# EAGLE design Ethernet_v1 (EAGLE 6.1)
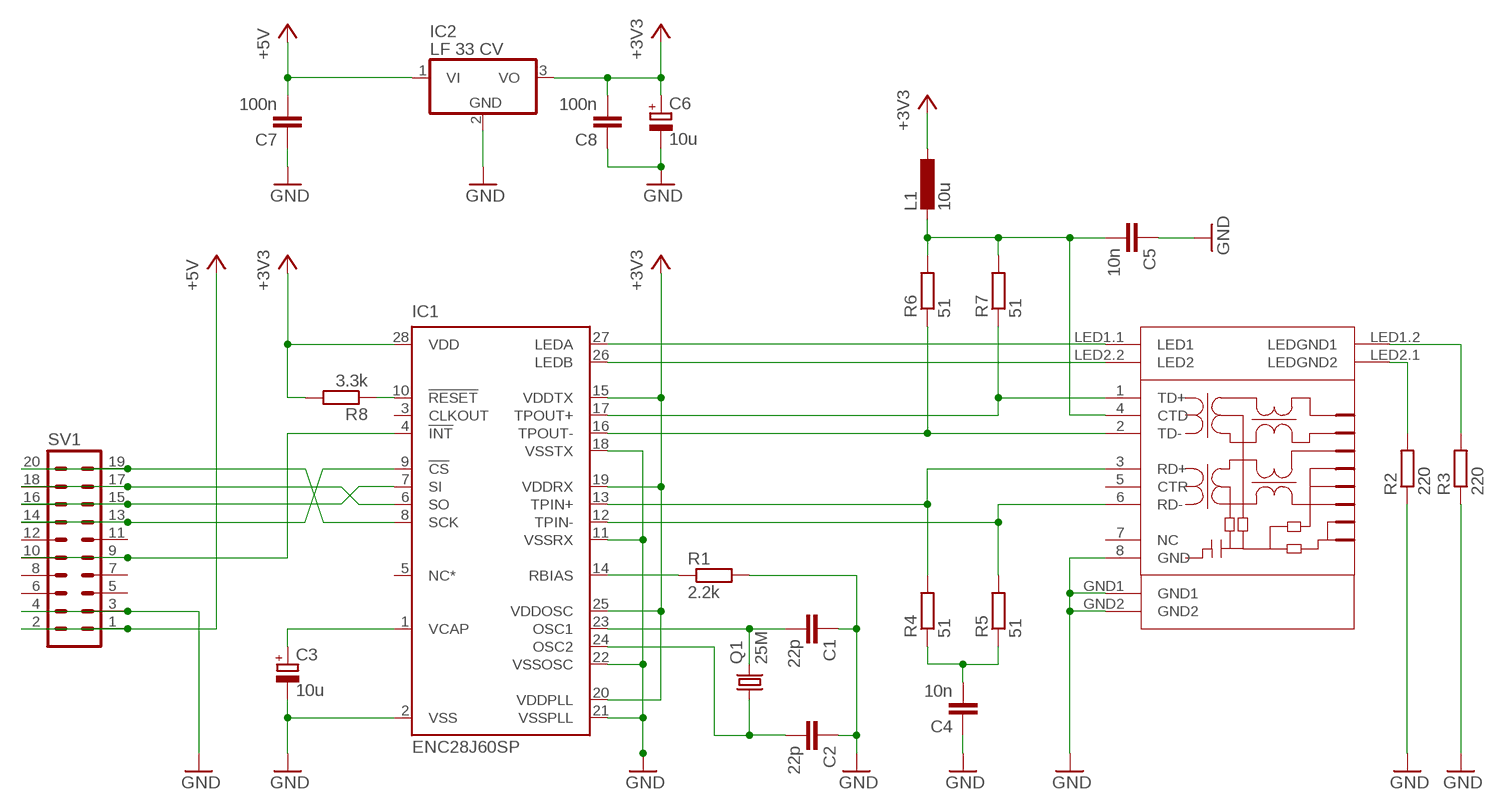
[diagram p0: schematic, sheet 1]

## Parts
C1  22p  C-EU025-024X044  [C025-024X044]
C2  22p  C-EU025-024X044  [C025-024X044]
C3  10u  CPOL-EUE2-5  [E2-5]
C4  10n  C-EU025-025X050  [C025-025X050]
C5  10n  C-EU025-025X050  [C025-025X050]
C6  10u  CPOL-EUE2-5  [E2-5]
C7  100n  C-EU025-025X050  [C025-025X050]
C8  100n  C-EU025-025X050  [C025-025X050]
IC1  ENC28J60SP  [DIL28-3]
IC2  LF 33 CV  788TV  [TO220V]
L1  10u  L-EU0207/10  [0207/10]
Q1  25M  CRYSTALHC49U-V  [HC49U-V]
R1  2.2k  R-EU_0207/2V  [0207/2V]
R2  220  R-EU_0207/2V  [0207/2V]
R3  220  R-EU_0207/2V  [0207/2V]
R4  51  R-EU_0207/2V  [0207/2V]
R5  51  R-EU_0207/2V  [0207/2V]
R6  51  R-EU_0207/2V  [0207/2V]
R7  51  R-EU_0207/2V  [0207/2V]
R8  3.3k  R-EU_0207/2V  [0207/2V]
SV1  MA10-2W  [MA10-2W]
U$1  TRJ0011  [TRJ0011]

## Nets
+3V3: C6.+ C8.2 IC1.15(VDDTX) IC1.19(VDDRX) IC1.20(VDDPLL) IC1.25(VDDOSC) IC1.28(VDD) IC2.3(VO) L1.1 R8.2
+5V: C7.2 IC2.1(VI) SV1.1 SV1.2
GND: C1.1 C2.1 C3.- C4.1 C5.1 C6.- C7.1 C8.1 IC1.2(VSS) IC1.11(VSSRX) IC1.18(VSSTX) IC1.21(VSSPLL) IC1.22(VSSOSC) IC2.2(GND) R1.2 R2.1 R3.1 SV1.3 SV1.4 U$1.8(GND) U$1.GND1 U$1.GND2
N$1: IC1.27(LEDA) U$1.LED1.1(LED1)
N$2: IC1.26(LEDB) U$1.LED2.2(LED2)
N$3: IC1.17(TPOUT+) R7.1 U$1.1(TD+)
N$4: IC1.16(TPOUT-) R6.1 U$1.2(TD-)
N$5: IC1.13(TPIN+) R4.2 U$1.3(RD+)
N$6: IC1.12(TPIN-) R5.2 U$1.6(RD-)
N$7: R2.2 U$1.LED2.1(LEDGND2)
N$8: C1.2 IC1.23(OSC1) Q1.2
N$9: IC1.14(RBIAS) R1.1
N$10: C2.2 IC1.24(OSC2) Q1.1
N$11: R3.2 U$1.LED1.2(LEDGND1)
N$12: C3.+ IC1.1(VCAP)
N$13: C4.2 R4.1 R5.1
N$14: C5.2 L1.2 R6.2 R7.2 U$1.4(CTD)
N$15: IC1.10(!RESET) R8.1
N$16: IC1.4(!INT) SV1.9 SV1.10
N$18: IC1.8(SCK) SV1.19 SV1.20
N$19: IC1.6(SO) SV1.17 SV1.18
N$20: IC1.7(SI) SV1.15 SV1.16
N$21: IC1.9(!CS) SV1.13 SV1.14
Unconnected: IC1.3(CLKOUT) IC1.5(NC*) SV1.5 SV1.6 SV1.7 SV1.8 SV1.11 SV1.12 U$1.5(CTR) U$1.7(NC)

## Library data of the parts
C1 C2 C4 C5 C7 C8 = rcl:C-EU: CAPACITOR, European symbol
C3 C6 = rcl:CPOL-EU: POLARIZED CAPACITOR, European symbol
IC1 = microchip:ENC28J60: Stand-Alone Ethernet Controller with SPI Interface Source: http://ww1.microchip.com/downloads/en/DeviceDoc/39662c.pdf; MF: MICROCHIP; MPN: ENC28J60/SP; OC_FARNELL: 1084619; OC_NEWARK: 96K3661
IC2 = linear:78*: Positive VOLTAGE REGULATOR Source: http://cache.national.com/ds/LM/LM78L05.pdf http://www.fairchildsemi.com/ds/LM/LM7805.pdf
L1 = rcl:L-EU: INDUCTOR, European symbol
Q1 = crystal:CRYSTAL: CRYSTAL; OC_FARNELL: 1666969; OC_NEWARK: unknown
R1-R8 = rcl:R-EU_: RESISTOR, European symbol
SV1 = con-lstb:MA10-2W: PIN HEADER; OC_FARNELL: unknown; OC_NEWARK: unknown
U$1 = Ethernet2:TRJ0011

## Board
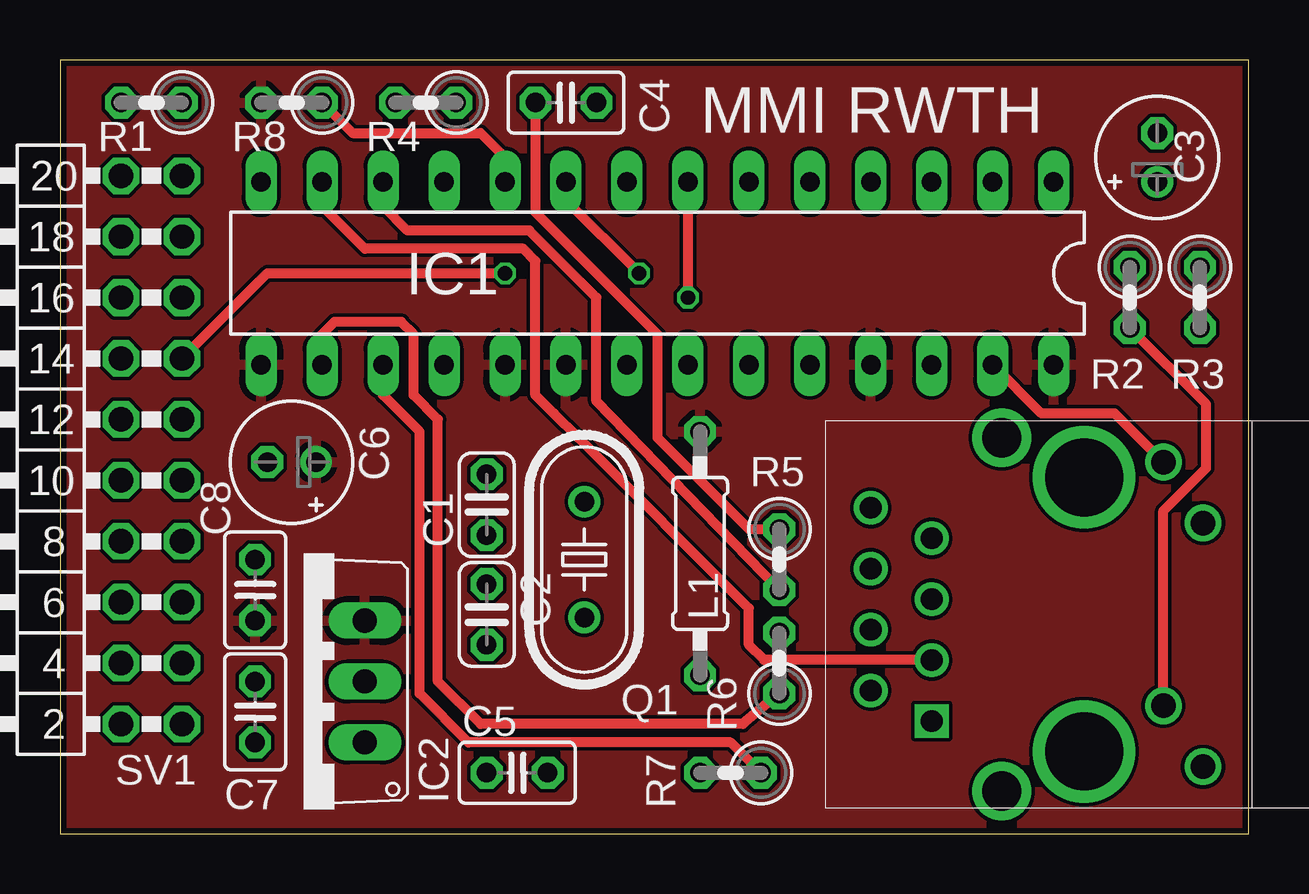
[diagram p1: board, top side]
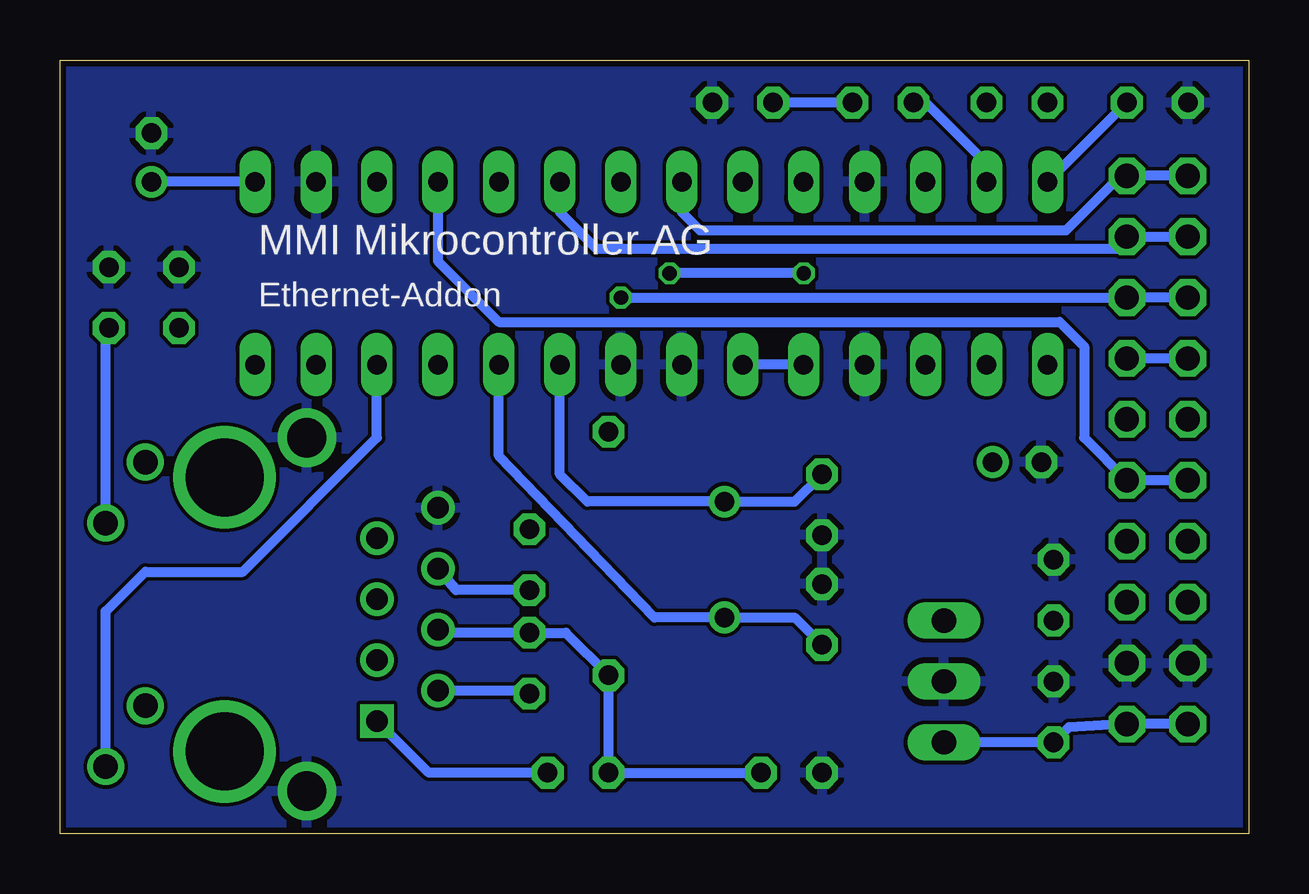
[diagram p2: board, bottom side, seen from below]

Size 49.53 x 32.26 mm. Coordinates in mm from the lower left corner, seen from the top.
Outline: 0,0 49.53,0 49.53,32.26 0,32.25 0,0
Copper layers (1*16): Top 0.035mm / dielectric 1.5mm / Bottom 0.035mm
Design rules: minimum track width 6mil, minimum drill 12mil, track to track 6mil, track to pad 6mil, pad to pad 6mil, via to via 6mil, smd to smd 0mil, copper to edge 10mil, drill to drill 10mil, minimum pad ring 10mil, minimum via ring 6mil, stop-mask expansion 2mil, vias tented up to drill 100mil, thermal gap 10mil

### Footprints (pad centres in the part's own frame; a part is rotated, then mirrored left to right if it is on the bottom)
C025-024X044 = drill 0.813 octagon: 1 -1.27,0; 2 1.27,0
E2-5 = drill 0.813 pad 1.27: + -1.016,0 | drill 0.813 pad 1.27 octagon: - 1.016,0
C025-025X050 = drill 0.813 octagon: 1 -1.27,0; 2 1.27,0
DIL28-3 = drill 0.813 long: 1 -16.51,-3.81; 2 -13.97,-3.81; 3 -11.43,-3.81; 4 -8.89,-3.81; 5 -6.35,-3.81; 6 -3.81,-3.81; 7 -1.27,-3.81; 8 1.27,-3.81; 9 3.81,-3.81; 10 6.35,-3.81; 11 8.89,-3.81; 12 11.43,-3.81; 13 13.97,-3.81; 14 16.51,-3.81; 15 16.51,3.81; 16 13.97,3.81; 17 11.43,3.81; 18 8.89,3.81; 19 6.35,3.81; 20 3.81,3.81; 21 1.27,3.81; 22 -1.27,3.81; 23 -3.81,3.81; 24 -6.35,3.81; 25 -8.89,3.81; 26 -11.43,3.81; 27 -13.97,3.81; 28 -16.51,3.81
TO220V = drill 1.016 long: 1 -2.54,-2.54; 2 0,-2.54; 3 2.54,-2.54
0207/10 = drill 0.813 octagon: 1 -5.08,0; 2 5.08,0
HC49U-V = drill 0.813: 1 -2.413,0; 2 2.413,0
0207/2V = drill 0.813 octagon: 1 -1.27,0; 2 1.27,0
MA10-2W = drill 1.016 octagon: 1 -11.43,-1.27; 2 -11.43,1.27; 3 -8.89,-1.27; 4 -8.89,1.27; 5 -6.35,-1.27; 6 -6.35,1.27; 7 -3.81,-1.27; 8 -3.81,1.27; 9 -1.27,-1.27; 10 -1.27,1.27; 11 1.27,-1.27; 12 1.27,1.27; 13 3.81,-1.27; 14 3.81,1.27; 15 6.35,-1.27; 16 6.35,1.27; 17 8.89,-1.27; 18 8.89,1.27; 19 11.43,-1.27; 20 11.43,1.27
TRJ0011 = drill 0.9 square: 1 -4.445,6.35 | drill 0.9: 2 -3.175,8.89; 3 -1.905,6.35; 4 -0.635,8.89; 5 0.635,6.35; 6 1.905,8.89; 7 3.175,6.35; 8 4.445,8.89 | drill 1.63: GND1 -7.366,3.429; GND2 7.366,3.429 | drill 1.02: LED1.1 6.35,-3.302; LED1.2 3.81,-4.953; LED2.1 -3.81,-3.302; LED2.2 -6.35,-4.953 | drill 3.25: PC -5.715,0; PC21 5.715,0

### Placement (x,y rotation side)
C1  17.78,13.72 90 top
C2  17.78,9.14 270 top
C3  45.72,28.19 90 top
C4  21.08,30.48 180 top
C5  19.05,2.54 0 top
C6  9.65,15.49 180 top
C7  8.13,5.08 270 top
C8  8.13,10.16 270 top
IC1  24.89,23.37 180 top
IC2  10.16,6.35 90 top
L1  26.67,11.68 270 top
Q1  21.84,11.43 90 top
R1  3.81,30.48 180 top
R2  44.58,22.35 270 top
R3  47.5,22.35 270 top
R4  15.24,30.48 180 top
R5  29.97,11.43 270 top
R6  29.97,7.11 90 top
R7  27.94,2.54 180 top
R8  9.65,30.48 180 top
SV1  3.81,16 90 top
U$1  42.67,9.14 90 top

### Tracks (layer width: path | path; a pad name or v marks a point on that pad's centre or on a via)
+3V3
  Bottom 0.406: IC1.19 IC1.20
  pour Top: 0,32.26 49.53,32.26 49.53,0 0,0
+5V
  Bottom 0.406: SV1.2 SV1.1 7.49,4.45 C7.2 IC2.1
GND
  pour Bottom: 0,0 49.53,0 49.53,32.26 0,32.26
N$1
  Top 0.406: U$1.LED1.1 43.94,17.53 40.89,17.53 IC1.27
N$2
  Bottom 0.406: U$1.LED2.2 47.62,9.27 45.97,10.92 41.91,10.92 36.32,16.51 IC1.26
N$3
  Top 0.406: R7.1 27.94,3.81 17.02,3.81 14.99,5.84 14.99,16.76 13.46,18.29 IC1.17
  Bottom 0.406: R7.1 34.16,2.54 U$1.1
N$4
  Top 0.406: R6.1 28.45,4.57 17.53,4.57 15.75,6.35 15.75,17.27 14.73,18.29 14.73,20.83 14.22,21.34 11.43,21.34 10.92,20.83 IC1.16
  Bottom 0.406: U$1.2 29.84,5.97 R6.1
N$5
  Top 0.406: U$1.3 29.34,7.24 28.7,7.87 28.7,9.4 21.59,16.51 20.57,17.53 19.81,18.29 19.81,23.88 19.3,24.38 12.7,24.38 10.92,26.16 IC1.13
  Bottom 0.406: R4.2 13.46,30.48 10.92,27.94 IC1.13
N$6
  Top 0.406: R5.2 22.35,18.03 22.35,22.35 19.56,25.15 14.48,25.15 13.46,26.16 IC1.12
  Bottom 0.406: R5.2 33.02,10.16 U$1.6
N$7
  Top 0.406: U$1.LED2.1 45.97,13.46 47.75,15.24 47.75,17.91 R2.2
N$8
  Bottom 0.406: C1.2 18.92,13.84 Q1.2 27.56,13.84 28.7,14.99 IC1.23
N$9
  Bottom 0.406: R1.1 IC1.14
N$10
  Bottom 0.406: C2.2 18.92,9.02 Q1.1 24.77,9.02 31.24,15.75 IC1.24
N$11
  Bottom 0.406: U$1.LED1.2 47.62,20.95 R3.2
N$12
  Bottom 0.406: IC1.1 C3.+
N$13
  Top 0.406: C4.2 19.81,25.91 24.89,20.83 24.89,16.51 28.7,12.7 R5.1
  Bottom 0.406: R4.1 C4.2
N$14
  Bottom 0.406: C5.2 R7.2 L1.2 28.45,8.38 R6.2 33.66,8.38 U$1.4
N$15
  Top 0.406: R8.1 12.19,29.21 17.53,29.21 18.54,28.19 IC1.10
N$16
  Bottom 0.406: SV1.10 SV1.9 6.86,16.51 6.86,20.32 7.87,21.34 31.24,21.34 33.78,23.88 IC1.4
N$18
  Bottom 0.406: SV1.20 SV1.19 5.33,27.43 7.62,25.15 22.86,25.15 23.62,25.91 IC1.8
N$19
  Bottom 0.406: SV1.18 SV1.17 5.46,24.38 27.18,24.38 28.7,25.91 IC1.6
N$20  (via drill 0.6)
  Top 0.406: IC1.7 v26.16,22.35
  Bottom 0.406: SV1.16 SV1.15 v26.16,22.35
N$21  (via drill 0.6)
  Top 0.406: SV1.13 8.64,23.37 v18.54,23.37 | v24.13,23.37 21.08,26.42 IC1.9
  Bottom 0.406: SV1.14 SV1.13 | v18.54,23.37 v24.13,23.37

### Text on the board
tPlace: MMI RWTH
bPlace: MMI Mikrocontroller AG | Ethernet-Addon